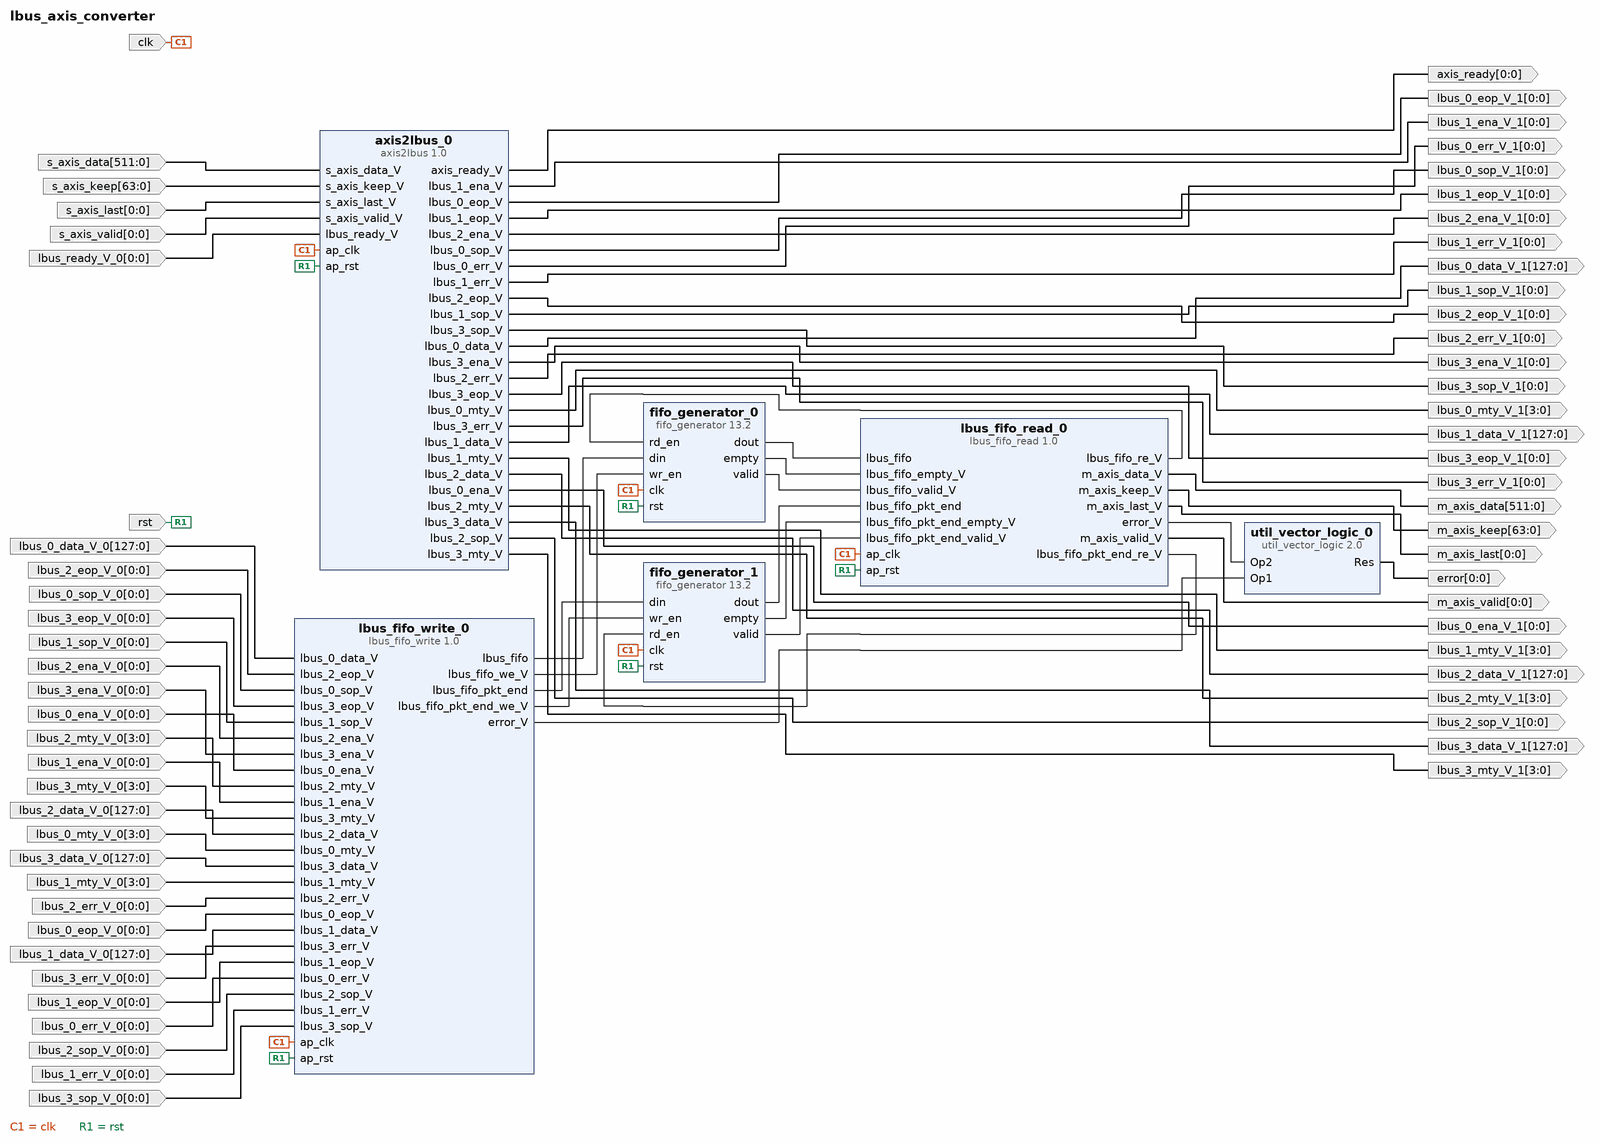
[diagram p0: block diagram of the top level]
# Vivado block design lbus_axis_converter, xczu19eg-ffvc1760-2-i, Vivado 2019.1
create_bd_design lbus_axis_converter

create_bd_port -dir O -from 0 -to 0 error
create_bd_port -dir I -type clk clk
create_bd_port -dir I -type rst rst
set_property -dict {CONFIG.POLARITY ACTIVE_HIGH} [get_bd_ports rst]
create_bd_port -dir O -from 511 -to 0 -type data m_axis_data
create_bd_port -dir O -from 63 -to 0 -type data m_axis_keep
create_bd_port -dir O -from 0 -to 0 -type data m_axis_last
create_bd_port -dir O -from 0 -to 0 -type data m_axis_valid
create_bd_port -dir I -from 511 -to 0 -type data s_axis_data
create_bd_port -dir I -from 63 -to 0 -type data s_axis_keep
create_bd_port -dir I -from 0 -to 0 -type data s_axis_last
create_bd_port -dir I -from 0 -to 0 -type data s_axis_valid
create_bd_port -dir O -from 0 -to 0 -type data axis_ready
create_bd_port -dir I -from 127 -to 0 -type data lbus_0_data_V_0
create_bd_port -dir I -from 0 -to 0 -type data lbus_2_eop_V_0
create_bd_port -dir I -from 0 -to 0 -type data lbus_0_sop_V_0
create_bd_port -dir I -from 0 -to 0 -type data lbus_3_eop_V_0
create_bd_port -dir I -from 0 -to 0 -type data lbus_1_sop_V_0
create_bd_port -dir I -from 0 -to 0 -type data lbus_2_ena_V_0
create_bd_port -dir I -from 0 -to 0 -type data lbus_3_ena_V_0
create_bd_port -dir I -from 0 -to 0 -type data lbus_0_ena_V_0
create_bd_port -dir I -from 3 -to 0 -type data lbus_2_mty_V_0
create_bd_port -dir I -from 0 -to 0 -type data lbus_1_ena_V_0
create_bd_port -dir I -from 3 -to 0 -type data lbus_3_mty_V_0
create_bd_port -dir I -from 127 -to 0 -type data lbus_2_data_V_0
create_bd_port -dir I -from 3 -to 0 -type data lbus_0_mty_V_0
create_bd_port -dir I -from 127 -to 0 -type data lbus_3_data_V_0
create_bd_port -dir I -from 3 -to 0 -type data lbus_1_mty_V_0
create_bd_port -dir I -from 0 -to 0 -type data lbus_2_err_V_0
create_bd_port -dir I -from 0 -to 0 -type data lbus_0_eop_V_0
create_bd_port -dir I -from 127 -to 0 -type data lbus_1_data_V_0
create_bd_port -dir I -from 0 -to 0 -type data lbus_3_err_V_0
create_bd_port -dir I -from 0 -to 0 -type data lbus_1_eop_V_0
create_bd_port -dir I -from 0 -to 0 -type data lbus_0_err_V_0
create_bd_port -dir I -from 0 -to 0 -type data lbus_2_sop_V_0
create_bd_port -dir I -from 0 -to 0 -type data lbus_1_err_V_0
create_bd_port -dir I -from 0 -to 0 -type data lbus_3_sop_V_0
create_bd_port -dir O -from 0 -to 0 -type data lbus_3_sop_V_1
create_bd_port -dir O -from 0 -to 0 -type data lbus_1_ena_V_1
create_bd_port -dir I -from 0 -to 0 -type data lbus_ready_V_0
create_bd_port -dir O -from 0 -to 0 -type data lbus_0_eop_V_1
create_bd_port -dir O -from 0 -to 0 -type data lbus_2_ena_V_1
create_bd_port -dir O -from 0 -to 0 -type data lbus_1_eop_V_1
create_bd_port -dir O -from 0 -to 0 -type data lbus_3_ena_V_1
create_bd_port -dir O -from 0 -to 0 -type data lbus_2_eop_V_1
create_bd_port -dir O -from 0 -to 0 -type data lbus_0_sop_V_1
create_bd_port -dir O -from 0 -to 0 -type data lbus_3_eop_V_1
create_bd_port -dir O -from 0 -to 0 -type data lbus_1_sop_V_1
create_bd_port -dir O -from 0 -to 0 -type data lbus_0_err_V_1
create_bd_port -dir O -from 0 -to 0 -type data lbus_1_err_V_1
create_bd_port -dir O -from 0 -to 0 -type data lbus_2_err_V_1
create_bd_port -dir O -from 0 -to 0 -type data lbus_3_err_V_1
create_bd_port -dir O -from 127 -to 0 -type data lbus_0_data_V_1
create_bd_port -dir O -from 3 -to 0 -type data lbus_0_mty_V_1
create_bd_port -dir O -from 127 -to 0 -type data lbus_1_data_V_1
create_bd_port -dir O -from 3 -to 0 -type data lbus_1_mty_V_1
create_bd_port -dir O -from 127 -to 0 -type data lbus_2_data_V_1
create_bd_port -dir O -from 3 -to 0 -type data lbus_2_mty_V_1
create_bd_port -dir O -from 127 -to 0 -type data lbus_3_data_V_1
create_bd_port -dir O -from 3 -to 0 -type data lbus_3_mty_V_1
create_bd_port -dir O -from 0 -to 0 -type data lbus_2_sop_V_1
create_bd_port -dir O -from 0 -to 0 -type data lbus_0_ena_V_1

create_bd_cell -type ip -vlnv xilinx.com:hls:lbus_fifo_read:1.0 lbus_fifo_read_0
create_bd_cell -type ip -vlnv xilinx.com:hls:lbus_fifo_write:1.0 lbus_fifo_write_0
create_bd_cell -type ip -vlnv xilinx.com:ip:fifo_generator:13.2 fifo_generator_0
set_property -dict [list \
  CONFIG.Fifo_Implementation Common_Clock_Distributed_RAM \
  CONFIG.Full_Flags_Reset_Value 1 \
  CONFIG.Input_Data_Width 544 \
  CONFIG.Input_Depth 16 \
  CONFIG.Reset_Type Asynchronous_Reset \
  CONFIG.Valid_Flag true \
] [get_bd_cells fifo_generator_0]
create_bd_cell -type ip -vlnv xilinx.com:ip:fifo_generator:13.2 fifo_generator_1
set_property -dict [list \
  CONFIG.Fifo_Implementation Common_Clock_Distributed_RAM \
  CONFIG.Full_Flags_Reset_Value 1 \
  CONFIG.Input_Data_Width 408 \
  CONFIG.Input_Depth 16 \
  CONFIG.Reset_Type Asynchronous_Reset \
  CONFIG.Valid_Flag true \
] [get_bd_cells fifo_generator_1]
create_bd_cell -type ip -vlnv xilinx.com:hls:axis2lbus:1.0 axis2lbus_0
create_bd_cell -type ip -vlnv xilinx.com:ip:util_vector_logic:2.0 util_vector_logic_0
set_property -dict {CONFIG.C_SIZE 1} [get_bd_cells util_vector_logic_0]

# ---- connections ----

connect_bd_net [get_bd_pins util_vector_logic_0/Res] [get_bd_ports error]
connect_bd_net -net ap_clk_0_1 [get_bd_ports clk] \
  [get_bd_pins lbus_fifo_write_0/ap_clk] [get_bd_pins lbus_fifo_read_0/ap_clk] [get_bd_pins fifo_generator_0/clk] \
  [get_bd_pins fifo_generator_1/clk] [get_bd_pins axis2lbus_0/ap_clk]
connect_bd_net -net ap_rst_0_1 [get_bd_ports rst] \
  [get_bd_pins lbus_fifo_write_0/ap_rst] [get_bd_pins lbus_fifo_read_0/ap_rst] [get_bd_pins fifo_generator_0/rst] \
  [get_bd_pins fifo_generator_1/rst] [get_bd_pins axis2lbus_0/ap_rst]
connect_bd_net [get_bd_pins lbus_fifo_read_0/m_axis_data_V] [get_bd_ports m_axis_data]
connect_bd_net [get_bd_pins lbus_fifo_read_0/m_axis_keep_V] [get_bd_ports m_axis_keep]
connect_bd_net [get_bd_pins lbus_fifo_read_0/m_axis_last_V] [get_bd_ports m_axis_last]
connect_bd_net [get_bd_pins lbus_fifo_read_0/m_axis_valid_V] [get_bd_ports m_axis_valid]
connect_bd_net -net s_axis_data_V_0_1 [get_bd_ports s_axis_data] [get_bd_pins axis2lbus_0/s_axis_data_V]
connect_bd_net -net s_axis_keep_V_0_1 [get_bd_ports s_axis_keep] [get_bd_pins axis2lbus_0/s_axis_keep_V]
connect_bd_net -net s_axis_last_V_0_1 [get_bd_ports s_axis_last] [get_bd_pins axis2lbus_0/s_axis_last_V]
connect_bd_net -net s_axis_valid_V_0_1 [get_bd_ports s_axis_valid] [get_bd_pins axis2lbus_0/s_axis_valid_V]
connect_bd_net [get_bd_pins axis2lbus_0/axis_ready_V] [get_bd_ports axis_ready]
connect_bd_net -net lbus_0_data_V_0_1 [get_bd_ports lbus_0_data_V_0] [get_bd_pins lbus_fifo_write_0/lbus_0_data_V]
connect_bd_net -net lbus_2_eop_V_0_1 [get_bd_ports lbus_2_eop_V_0] [get_bd_pins lbus_fifo_write_0/lbus_2_eop_V]
connect_bd_net -net lbus_0_sop_V_0_1 [get_bd_ports lbus_0_sop_V_0] [get_bd_pins lbus_fifo_write_0/lbus_0_sop_V]
connect_bd_net -net lbus_3_eop_V_0_1 [get_bd_ports lbus_3_eop_V_0] [get_bd_pins lbus_fifo_write_0/lbus_3_eop_V]
connect_bd_net -net lbus_1_sop_V_0_1 [get_bd_ports lbus_1_sop_V_0] [get_bd_pins lbus_fifo_write_0/lbus_1_sop_V]
connect_bd_net -net lbus_2_ena_V_0_1 [get_bd_ports lbus_2_ena_V_0] [get_bd_pins lbus_fifo_write_0/lbus_2_ena_V]
connect_bd_net -net lbus_3_ena_V_0_1 [get_bd_ports lbus_3_ena_V_0] [get_bd_pins lbus_fifo_write_0/lbus_3_ena_V]
connect_bd_net -net lbus_0_ena_V_0_1 [get_bd_ports lbus_0_ena_V_0] [get_bd_pins lbus_fifo_write_0/lbus_0_ena_V]
connect_bd_net -net lbus_2_mty_V_0_1 [get_bd_ports lbus_2_mty_V_0] [get_bd_pins lbus_fifo_write_0/lbus_2_mty_V]
connect_bd_net -net lbus_1_ena_V_0_1 [get_bd_ports lbus_1_ena_V_0] [get_bd_pins lbus_fifo_write_0/lbus_1_ena_V]
connect_bd_net -net lbus_3_mty_V_0_1 [get_bd_ports lbus_3_mty_V_0] [get_bd_pins lbus_fifo_write_0/lbus_3_mty_V]
connect_bd_net -net lbus_2_data_V_0_1 [get_bd_ports lbus_2_data_V_0] [get_bd_pins lbus_fifo_write_0/lbus_2_data_V]
connect_bd_net -net lbus_0_mty_V_0_1 [get_bd_ports lbus_0_mty_V_0] [get_bd_pins lbus_fifo_write_0/lbus_0_mty_V]
connect_bd_net -net lbus_3_data_V_0_1 [get_bd_ports lbus_3_data_V_0] [get_bd_pins lbus_fifo_write_0/lbus_3_data_V]
connect_bd_net -net lbus_1_mty_V_0_1 [get_bd_ports lbus_1_mty_V_0] [get_bd_pins lbus_fifo_write_0/lbus_1_mty_V]
connect_bd_net -net lbus_2_err_V_0_1 [get_bd_ports lbus_2_err_V_0] [get_bd_pins lbus_fifo_write_0/lbus_2_err_V]
connect_bd_net -net lbus_0_eop_V_0_1 [get_bd_ports lbus_0_eop_V_0] [get_bd_pins lbus_fifo_write_0/lbus_0_eop_V]
connect_bd_net -net lbus_1_data_V_0_1 [get_bd_ports lbus_1_data_V_0] [get_bd_pins lbus_fifo_write_0/lbus_1_data_V]
connect_bd_net -net lbus_3_err_V_0_1 [get_bd_ports lbus_3_err_V_0] [get_bd_pins lbus_fifo_write_0/lbus_3_err_V]
connect_bd_net -net lbus_1_eop_V_0_1 [get_bd_ports lbus_1_eop_V_0] [get_bd_pins lbus_fifo_write_0/lbus_1_eop_V]
connect_bd_net -net lbus_0_err_V_0_1 [get_bd_ports lbus_0_err_V_0] [get_bd_pins lbus_fifo_write_0/lbus_0_err_V]
connect_bd_net -net lbus_2_sop_V_0_1 [get_bd_ports lbus_2_sop_V_0] [get_bd_pins lbus_fifo_write_0/lbus_2_sop_V]
connect_bd_net -net lbus_1_err_V_0_1 [get_bd_ports lbus_1_err_V_0] [get_bd_pins lbus_fifo_write_0/lbus_1_err_V]
connect_bd_net -net lbus_3_sop_V_0_1 [get_bd_ports lbus_3_sop_V_0] [get_bd_pins lbus_fifo_write_0/lbus_3_sop_V]
connect_bd_net [get_bd_pins axis2lbus_0/lbus_3_sop_V] [get_bd_ports lbus_3_sop_V_1]
connect_bd_net [get_bd_pins axis2lbus_0/lbus_1_ena_V] [get_bd_ports lbus_1_ena_V_1]
connect_bd_net -net lbus_ready_V_0_1 [get_bd_ports lbus_ready_V_0] [get_bd_pins axis2lbus_0/lbus_ready_V]
connect_bd_net [get_bd_pins axis2lbus_0/lbus_0_eop_V] [get_bd_ports lbus_0_eop_V_1]
connect_bd_net [get_bd_pins axis2lbus_0/lbus_2_ena_V] [get_bd_ports lbus_2_ena_V_1]
connect_bd_net [get_bd_pins axis2lbus_0/lbus_1_eop_V] [get_bd_ports lbus_1_eop_V_1]
connect_bd_net [get_bd_pins axis2lbus_0/lbus_3_ena_V] [get_bd_ports lbus_3_ena_V_1]
connect_bd_net [get_bd_pins axis2lbus_0/lbus_2_eop_V] [get_bd_ports lbus_2_eop_V_1]
connect_bd_net [get_bd_pins axis2lbus_0/lbus_0_sop_V] [get_bd_ports lbus_0_sop_V_1]
connect_bd_net [get_bd_pins axis2lbus_0/lbus_3_eop_V] [get_bd_ports lbus_3_eop_V_1]
connect_bd_net [get_bd_pins axis2lbus_0/lbus_1_sop_V] [get_bd_ports lbus_1_sop_V_1]
connect_bd_net [get_bd_pins axis2lbus_0/lbus_0_err_V] [get_bd_ports lbus_0_err_V_1]
connect_bd_net [get_bd_pins axis2lbus_0/lbus_1_err_V] [get_bd_ports lbus_1_err_V_1]
connect_bd_net [get_bd_pins axis2lbus_0/lbus_2_err_V] [get_bd_ports lbus_2_err_V_1]
connect_bd_net [get_bd_pins axis2lbus_0/lbus_3_err_V] [get_bd_ports lbus_3_err_V_1]
connect_bd_net [get_bd_pins axis2lbus_0/lbus_0_data_V] [get_bd_ports lbus_0_data_V_1]
connect_bd_net [get_bd_pins axis2lbus_0/lbus_0_mty_V] [get_bd_ports lbus_0_mty_V_1]
connect_bd_net [get_bd_pins axis2lbus_0/lbus_1_data_V] [get_bd_ports lbus_1_data_V_1]
connect_bd_net [get_bd_pins axis2lbus_0/lbus_1_mty_V] [get_bd_ports lbus_1_mty_V_1]
connect_bd_net [get_bd_pins axis2lbus_0/lbus_2_data_V] [get_bd_ports lbus_2_data_V_1]
connect_bd_net [get_bd_pins axis2lbus_0/lbus_2_mty_V] [get_bd_ports lbus_2_mty_V_1]
connect_bd_net [get_bd_pins axis2lbus_0/lbus_3_data_V] [get_bd_ports lbus_3_data_V_1]
connect_bd_net [get_bd_pins axis2lbus_0/lbus_3_mty_V] [get_bd_ports lbus_3_mty_V_1]
connect_bd_net [get_bd_pins axis2lbus_0/lbus_2_sop_V] [get_bd_ports lbus_2_sop_V_1]
connect_bd_net [get_bd_pins axis2lbus_0/lbus_0_ena_V] [get_bd_ports lbus_0_ena_V_1]
connect_bd_net [get_bd_pins lbus_fifo_write_0/lbus_fifo] [get_bd_pins fifo_generator_0/din]
connect_bd_net [get_bd_pins lbus_fifo_write_0/lbus_fifo_we_V] [get_bd_pins fifo_generator_0/wr_en]
connect_bd_net [get_bd_pins lbus_fifo_write_0/lbus_fifo_pkt_end] [get_bd_pins fifo_generator_1/din]
connect_bd_net [get_bd_pins lbus_fifo_write_0/lbus_fifo_pkt_end_we_V] [get_bd_pins fifo_generator_1/wr_en]
connect_bd_net [get_bd_pins fifo_generator_0/dout] [get_bd_pins lbus_fifo_read_0/lbus_fifo]
connect_bd_net [get_bd_pins fifo_generator_0/empty] [get_bd_pins lbus_fifo_read_0/lbus_fifo_empty_V]
connect_bd_net [get_bd_pins lbus_fifo_read_0/lbus_fifo_re_V] [get_bd_pins fifo_generator_0/rd_en]
connect_bd_net [get_bd_pins fifo_generator_1/dout] [get_bd_pins lbus_fifo_read_0/lbus_fifo_pkt_end]
connect_bd_net [get_bd_pins fifo_generator_1/empty] [get_bd_pins lbus_fifo_read_0/lbus_fifo_pkt_end_empty_V]
connect_bd_net [get_bd_pins lbus_fifo_read_0/lbus_fifo_pkt_end_re_V] [get_bd_pins fifo_generator_1/rd_en]
connect_bd_net [get_bd_pins fifo_generator_0/valid] [get_bd_pins lbus_fifo_read_0/lbus_fifo_valid_V]
connect_bd_net [get_bd_pins fifo_generator_1/valid] [get_bd_pins lbus_fifo_read_0/lbus_fifo_pkt_end_valid_V]
connect_bd_net [get_bd_pins lbus_fifo_write_0/error_V] [get_bd_pins util_vector_logic_0/Op1]
connect_bd_net [get_bd_pins lbus_fifo_read_0/error_V] [get_bd_pins util_vector_logic_0/Op2]

validate_bd_design
save_bd_design
